# Altium schematic sheet ASI-CANOpen.SchDoc
size 209 x 297 mm; _Razrabotal: {Разработал}; _Proveril: {Проверил}; _TKontr: {Т.контр}; _NKontr: {Н.контр}; _Utverdil: {Утвердил}
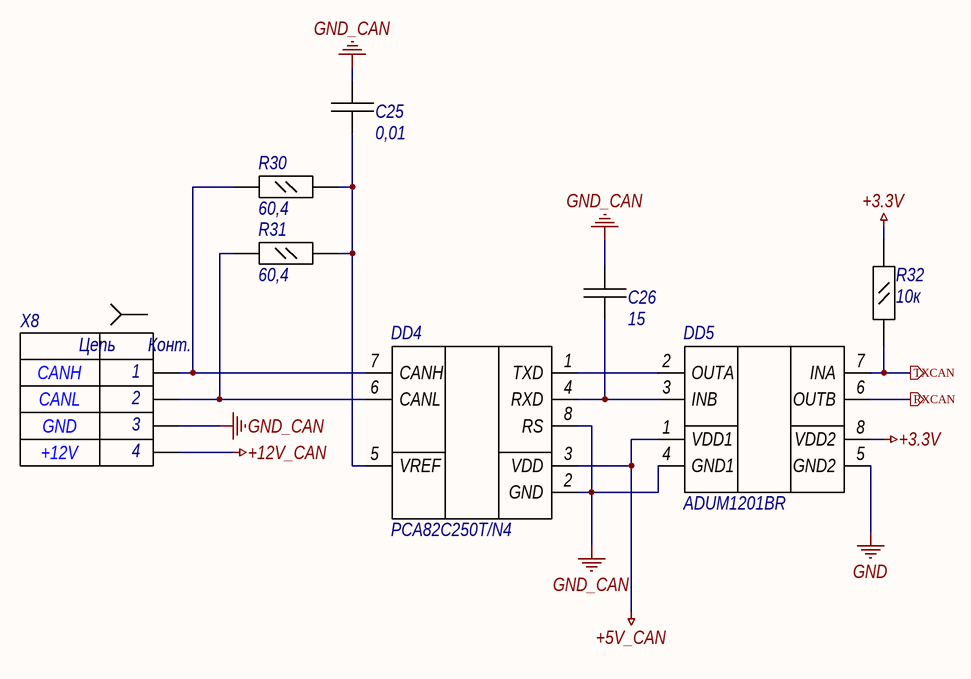
[diagram p0: ASI-CANOpen.SchDoc]

## Parts
C25  0,01  [0805]
C26  15  [0805]
DD4  PCA82C250T/N4  [SO-8]
DD5  ADUM1201BR  [SO-8]
R30  60,4  [0805]
R31  60,4  [0805]
R32  10к  [0805]
X8  TJ3-4P4C  [TJ3-4P4C]  (value not drawn)

## Ports
RXCAN, TXCAN

## Nets
+3.3V: DD5.8(VDD2) R32.2
+5V_CAN: DD4.3(VDD) DD5.1(VDD1)
+12V_CAN: X8.4
GND: DD5.5(GND2)
GND_CAN: C25.2 C26.2 DD4.2(GND) DD4.8(RS) DD5.4(GND1) X8.3
RXCAN: DD5.6(OUTB) ; port RXCAN
TXCAN: DD5.7(INA) R32.1 ; port TXCAN
NetC25_1: C25.1 DD4.5(VREF) R30.2 R31.2
NetC26_1: C26.1 DD4.4(RXD) DD5.3(INB)
NetDD4_1: DD4.1(TXD) DD5.2(OUTA)
NetDD4_6: DD4.6(CANL) R31.1 X8.2
NetDD4_7: DD4.7(CANH) R30.1 X8.1

## Notes on the sheet
- CANH
- CANL
- GND
- +12V
- Перв. примен.
- Справ. №
- Подп. и дата
- Инв.№ дубл.
- Взам. инв.№
- Инв. № подп.
- Лист
- Изм.
- № докум.
- Подпись
- Дата
- Копировал
- Формат      А4
- (in symbol TJ3-4P4C) Цепь; Конт.

## Library data of the parts
C25 C26 = CC0805: Конденсатор; Manufacturer: YAGEO; Accuracy: 10%; CVoltage: 50 В; TC Material: X7R; ComponentName: СС0805; PackageName: 0805; ComponentType: Конденсатор
  C25: Value: 0,01
  C26: Value: 15
DD4 = PCA82C250T: Интерфейс физического уровня CAN; Manufacturer: NXP; PackageName: SO-8; ComponentType: Микросхема; ComponentName: PCA82C250T/N4
DD5 = ADUM1201: Изолятор цифрового сигнала; Manufacturer: Analog Dev.; PackageName: SO-8; ComponentType: Микросхема; ComponentName: ADUM1201BR
R30-R32 = RC0805JR: Резистор общего назначения 5%; Manufacturer: YAGEO; PackageName: 0805; ComponentType: Резистор; Accuracy: 5%; ComponentName: RC0805JR
  R30 R31: Value: 60,4
  R32: Value: 10к
X8 = TJ3-4P4C: Разъем, гнездо на плату, прямой; ComponentType: Разъем; ComponentName: TJ3-4P4C